# Altium schematic sheet 1_main.SchDoc
size A4
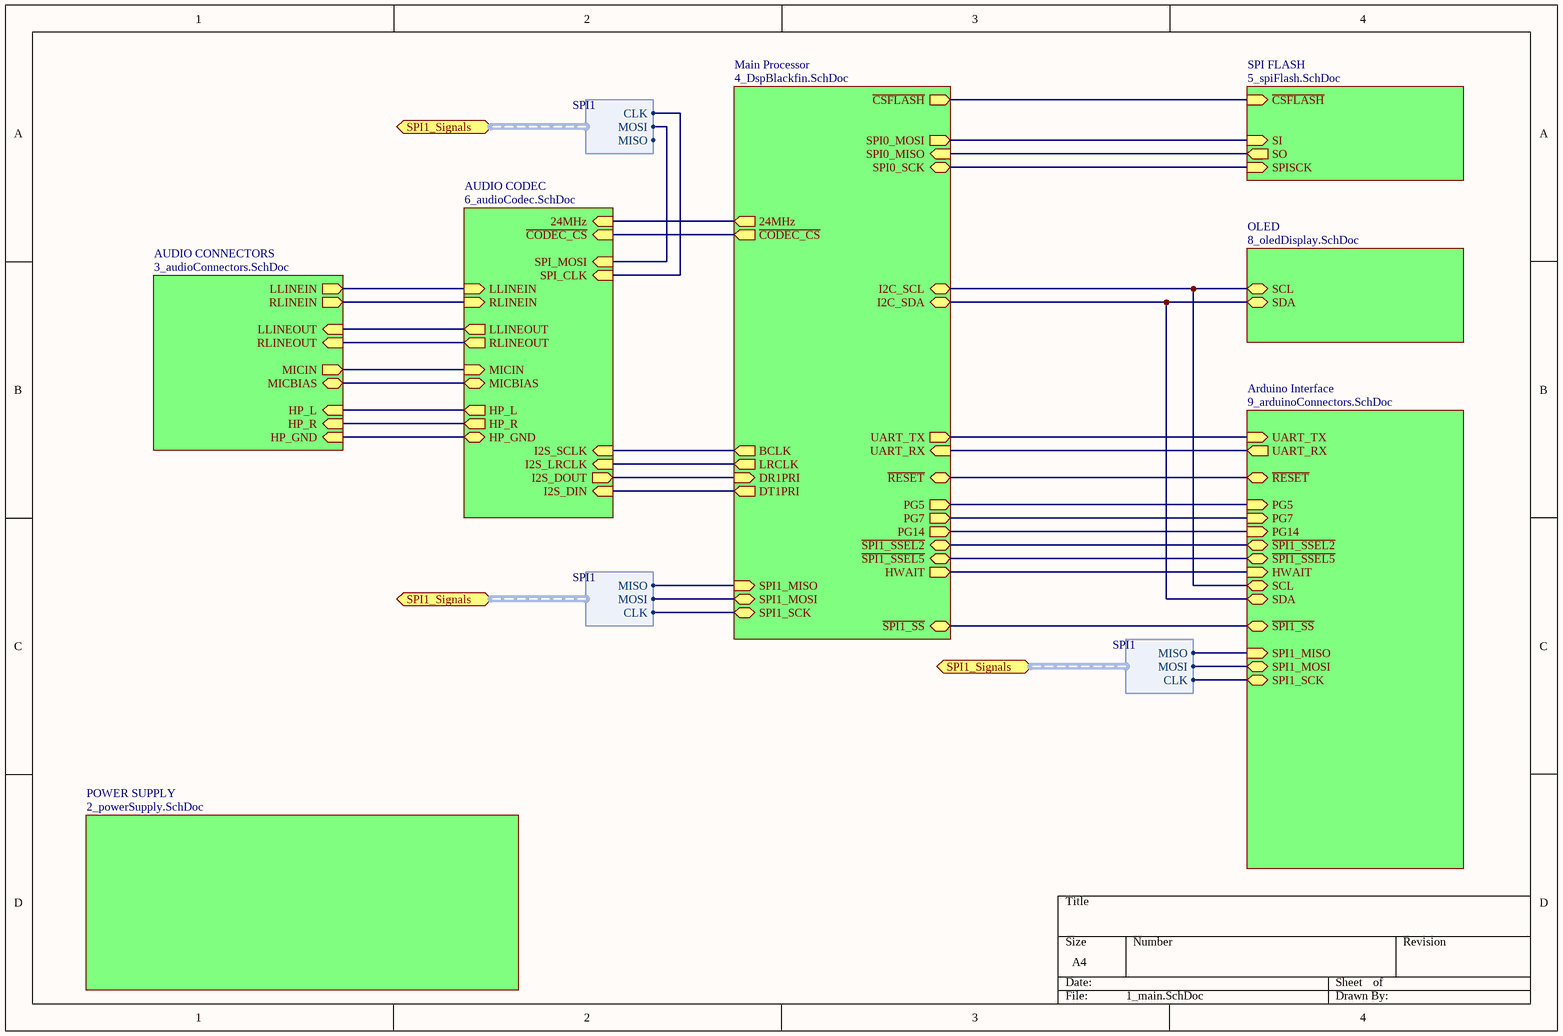
[diagram p0: 1_main.SchDoc]

## Sub-sheets
Arduino Interface = 9_arduinoConnectors.SchDoc: PG7 (in), UART_TX (in), ~{SPI1_SS} (bidir), SPI1_SCK (bidir), ~{RESET} (bidir), ~{SPI1_SSEL5} (bidir), PG14 (in), PG5 (in), SPI1_MISO (in), SDA (bidir), SPI1_MOSI (bidir), ~{SPI1_SSEL2} (bidir), SCL (bidir), UART_RX (out), HWAIT (in)
AUDIO CODEC = 6_audioCodec.SchDoc: LLINEIN (in), LLINEOUT (out), RLINEIN (in), RLINEOUT (out), MICIN (in), MICBIAS (bidir), HP_R (out), HP_L (out), HP_GND (bidir), SPI_MOSI (in), SPI_CLK (in), I2S_DIN (in), I2S_SCLK (in), I2S_LRCLK (in), 24MHz (in), I2S_DOUT (out), ~{CODEC_CS} (in)
AUDIO CONNECTORS = 3_audioConnectors.SchDoc: LLINEIN (out), LLINEOUT (in), HP_R (in), RLINEOUT (in), HP_GND (in), MICIN (out), RLINEIN (out), HP_L (in), MICBIAS (bidir)
Main Processor = 4_DspBlackfin.SchDoc: SPI0_MISO (in), ~{CSFLASH} (out), SPI0_MOSI (out), SPI0_SCK (bidir), I2C_SDA (bidir), I2C_SCL (bidir), BCLK (out), DT1PRI (out), LRCLK (out), DR1PRI (in), SPI1_MOSI (bidir), SPI1_SCK (bidir), SPI1_MISO (in), 24MHz (out), ~{CODEC_CS} (out), UART_TX (out), UART_RX (in), ~{RESET} (bidir), ~{SPI1_SSEL5} (bidir), ~{SPI1_SSEL2} (bidir), PG5 (out), PG14 (out), PG7 (out), ~{SPI1_SS} (bidir), HWAIT (out)
OLED = 8_oledDisplay.SchDoc: SCL (bidir), SDA (bidir)
POWER SUPPLY = 2_powerSupply.SchDoc: no entries
SPI FLASH = 5_spiFlash.SchDoc: ~{CSFLASH} (in), SI (in), SO (out), SPISCK (in)

## Ports
SPI1_Signals (harness SPI1)

## Harnesses
SPI1: MISO, MOSI, CLK
SPI1: MOSI, CLK, MISO

## Nets
(unnamed): sheet Main Processor/SPI0_MISO, sheet SPI FLASH/SO
(unnamed): sheet Main Processor/~{CSFLASH}, sheet SPI FLASH/~{CSFLASH}
(unnamed): sheet Main Processor/SPI0_MOSI, sheet SPI FLASH/SI
(unnamed): sheet Main Processor/SPI0_SCK, sheet SPI FLASH/SPISCK
(unnamed): sheet Main Processor/I2C_SDA, sheet OLED/SDA, sheet Arduino Interface/SDA
(unnamed): sheet Main Processor/I2C_SCL, sheet OLED/SCL, sheet Arduino Interface/SCL
(unnamed): sheet Main Processor/BCLK, sheet AUDIO CODEC/I2S_SCLK
(unnamed): sheet Main Processor/DT1PRI, sheet AUDIO CODEC/I2S_DIN
(unnamed): sheet Main Processor/LRCLK, sheet AUDIO CODEC/I2S_LRCLK
(unnamed): sheet Main Processor/DR1PRI, sheet AUDIO CODEC/I2S_DOUT
(unnamed): sheet Main Processor/SPI1_MOSI, sheet Arduino Interface/SPI1_MOSI, sheet AUDIO CODEC/SPI_MOSI, port SPI1_Signals.MOSI
(unnamed): sheet Main Processor/SPI1_SCK, sheet Arduino Interface/SPI1_SCK, sheet AUDIO CODEC/SPI_CLK, port SPI1_Signals.CLK
(unnamed): sheet Main Processor/SPI1_MISO, sheet Arduino Interface/SPI1_MISO, port SPI1_Signals.MISO
(unnamed): sheet Main Processor/24MHz, sheet AUDIO CODEC/24MHz
(unnamed): sheet Main Processor/~{CODEC_CS}, sheet AUDIO CODEC/~{CODEC_CS}
(unnamed): sheet Main Processor/UART_TX, sheet Arduino Interface/UART_TX
(unnamed): sheet Main Processor/UART_RX, sheet Arduino Interface/UART_RX
(unnamed): sheet Main Processor/~{RESET}, sheet Arduino Interface/~{RESET}
(unnamed): sheet Main Processor/~{SPI1_SSEL5}, sheet Arduino Interface/~{SPI1_SSEL5}
(unnamed): sheet Main Processor/~{SPI1_SSEL2}, sheet Arduino Interface/~{SPI1_SSEL2}
(unnamed): sheet Main Processor/PG5, sheet Arduino Interface/PG5
(unnamed): sheet Main Processor/PG14, sheet Arduino Interface/PG14
(unnamed): sheet Main Processor/PG7, sheet Arduino Interface/PG7
(unnamed): sheet Main Processor/~{SPI1_SS}, sheet Arduino Interface/~{SPI1_SS}
(unnamed): sheet Main Processor/HWAIT, sheet Arduino Interface/HWAIT
(unnamed): sheet AUDIO CODEC/LLINEIN, sheet AUDIO CONNECTORS/LLINEIN
(unnamed): sheet AUDIO CODEC/LLINEOUT, sheet AUDIO CONNECTORS/LLINEOUT
(unnamed): sheet AUDIO CODEC/RLINEIN, sheet AUDIO CONNECTORS/RLINEIN
(unnamed): sheet AUDIO CODEC/RLINEOUT, sheet AUDIO CONNECTORS/RLINEOUT
(unnamed): sheet AUDIO CODEC/MICIN, sheet AUDIO CONNECTORS/MICIN
(unnamed): sheet AUDIO CODEC/MICBIAS, sheet AUDIO CONNECTORS/MICBIAS
(unnamed): sheet AUDIO CODEC/HP_R, sheet AUDIO CONNECTORS/HP_R
(unnamed): sheet AUDIO CODEC/HP_L, sheet AUDIO CONNECTORS/HP_L
(unnamed): sheet AUDIO CODEC/HP_GND, sheet AUDIO CONNECTORS/HP_GND